# EAGLE design SmartSwitch (EAGLE 7.2.0)
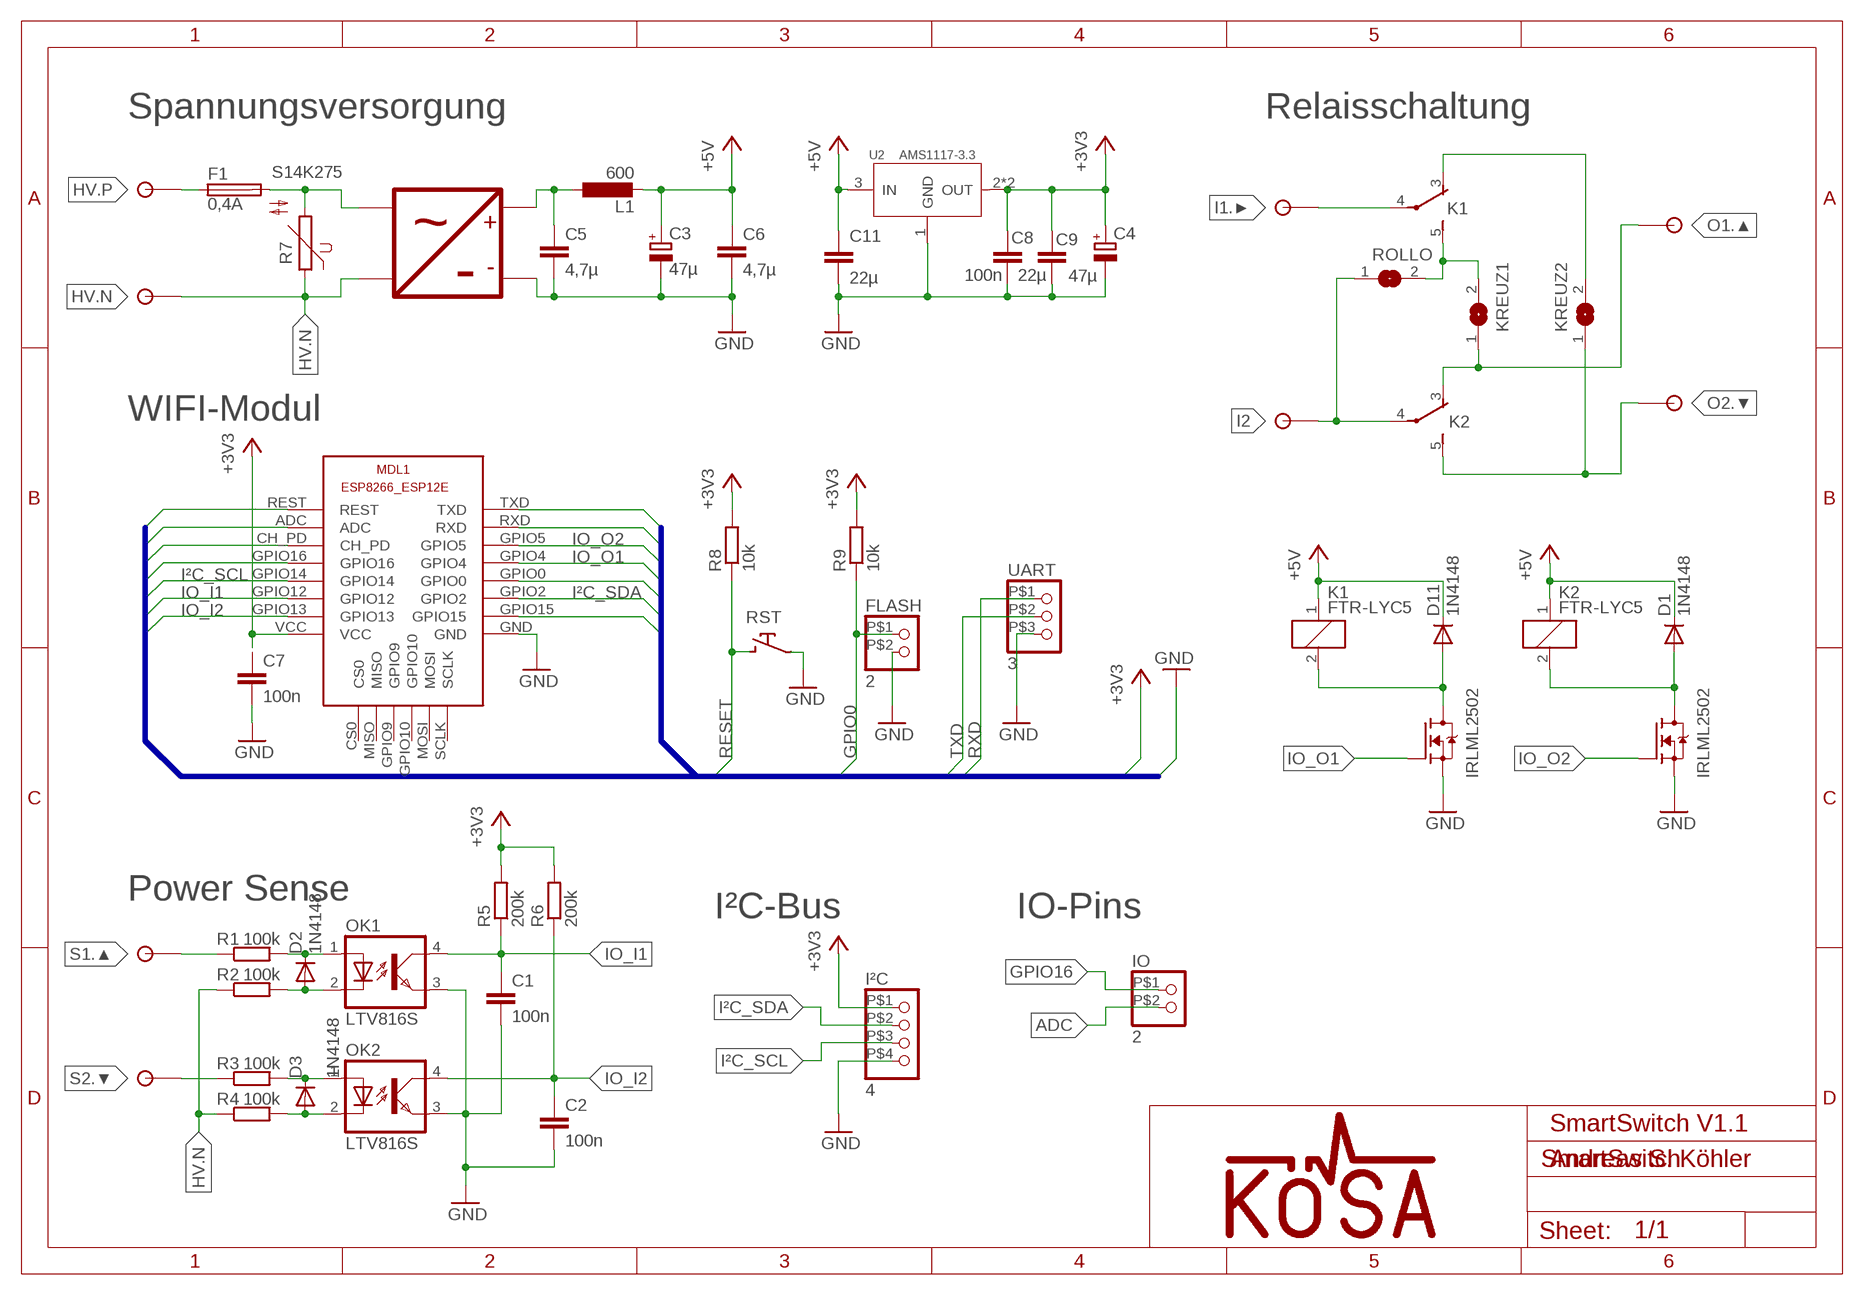
[diagram p0: schematic, sheet 1]

## Parts
C1  100n  C-EUC0805  [C0805]
C2  100n  C-EUC0805  [C0805]
C3  47µ  CPOL-EUE2-5  [E2-5]
C4  47µ  CPOL-EUE2-5  [E2-5]
C5  4,7µ  C-EUC0805  [C0805]
C6  4,7µ  C-EUC0805  [C0805]
C7  100n  C-EUC0805  [C0805]
C8  100n  C-EUC0805  [C0805]
C9  22µ  C-EUC0805  [C0805]
C11  22µ  C-EUC0805  [C0805]
D1  1N4148  DIODE-SOD323-W  [SOD323-W]
D2  1N4148  DIODE-SOD323-W  [SOD323-W]
D3  1N4148  DIODE-SOD323-W  [SOD323-W]
D11  1N4148  DIODE-SOD323-W  [SOD323-W]
F1  0,4A  SMD_FUSE_HOLDER  [SMD_FUSE_HOLDER]
FLASH  2  PINHD-1X2SMALL  [1X02_SMALL]
IO  2  PINHD-1X2SMALL  [1X02_SMALL]
I²C  4  PINHD-1X4SMALL  [1X04_SMALL]
K1  FTR-LYC5  [FTR-LYC]
K2  FTR-LYC5  [FTR-LYC]
KREUZ1  SJW  [SJW]
KREUZ2  SJW  [SJW]
L1  600  L-EUL3225P  [L3225P]
MDL1  1  ESP8266-12EESP8266-ESP12E  [ESP8266-ESP12E]
OK1  LTV816S  [SMD4]
OK2  LTV816S  [SMD4]
R1  100k  R-EU_R1206  [R1206]
R2  100k  R-EU_R1206  [R1206]
R3  100k  R-EU_R1206  [R1206]
R4  100k  R-EU_R1206  [R1206]
R5  200k  R-EU_R1206  [R1206]
R6  200k  R-EU_R1206  [R1206]
R7  S14K275  [S14K275]
R8  10k  R-EU_R1206  [R1206]
R9  10k  R-EU_R1206  [R1206]
ROLLO  SJW  [SJW]
RST  SMD-TASTER_REICHELT_KMR_231_G_LFS  [SMD-TASTER_REICHELT_KMR_231_G_LFS]
U2  AMS1117-3.3  PMIC-CJT1117-3.3(SOT223)  [SOT-223]
U$1  HLK-PM01  [HLK-PM01]
U$2  RND_205-00276  [RND205-00276]
U$3  RND_205-00276  [RND205-00276]
U$4  RND_205-00276  [RND205-00276]
U$5  RND_205-00276  [RND205-00276]
U$7  IRLML2502  [SOT23]
U$8  IRLML2502  [SOT23]
UART  3  PINHD-1X3SMALL  [1X03_SMALL]

## Nets
+3V3: C4.+ C7.1 C8.1 C9.1 I²C.P$1 MDL1.CH_PD MDL1.VCC R5.2 R6.2 R8.2 R9.2 U2.2(OUT) U2.TER(OUT)
+5V: C3.+ C6.1 C11.1 D1.C D11.C K1.1 K2.1 L1.2 U2.3(IN)
ADC: IO.P$2 MDL1.ADC
GND: C1.2 C2.2 C3.- C4.- C5.2 C6.2 C7.2 C8.2 C9.2 C11.2 FLASH.P$2 I²C.P$4 MDL1.GND MDL1.GPIO15 OK1.3(EMIT) OK2.3(EMIT) RST.1_1(A) RST.1_2(A) U2.1(GND) U$1.DC- U$7.2(S) U$8.2(S) UART.P$3
GPIO0: FLASH.P$1 MDL1.GPIO0 R9.1
GPIO16: IO.P$1 MDL1.GPIO16
HV.N: R2.1 R4.1 R7.1 U$1.AC2 U$2.P$2
HV.P: F1.P$1 U$2.P$1
I1.►: K1.4(-1:P) U$4.P$1
I2: K2.4(-1:P) ROLLO.1 U$3.P$1
IO_I1: C1.1 MDL1.GPIO12 OK1.4(COL) R5.1
IO_I2: C2.1 MDL1.GPIO13 OK2.4(COL) R6.1
IO_O1: MDL1.GPIO4 U$7.1(G)
IO_O2: MDL1.GPIO5 U$8.1(G)
I²C_SCL: I²C.P$3 MDL1.GPIO14
I²C_SDA: I²C.P$2 MDL1.GPIO2
N$3: K1.5(-1:S) KREUZ1.2 ROLLO.2
N$5: K1.3(-1:O) KREUZ2.2
N$7: C5.1 L1.1 U$1.DC+
N$8: F1.P$2 R7.2 U$1.AC1
N$11: D2.C OK1.1(A) R1.2
N$12: D3.C OK2.1(A) R3.2
N$13: D2.A OK1.2(C) R2.2
N$14: D3.A OK2.2(C) R4.2
N$17: D11.A K1.2 U$7.3(D)
N$19: D1.A K2.2 U$8.3(D)
O1.▲: K2.3(-1:O) KREUZ1.1 U$3.P$2
O2.▼: K2.5(-1:S) KREUZ2.1 U$4.P$2
RESET: MDL1.REST R8.1 RST.2_1(B) RST.2_2(B)
RXD: MDL1.RXD UART.P$1
S1.▲: R1.1 U$5.P$2
S2.▼: R3.1 U$5.P$1
TXD: MDL1.TXD UART.P$2
Unconnected: MDL1.CS0 MDL1.GPIO9 MDL1.GPIO10 MDL1.MISO MDL1.MOSI MDL1.SCLK

## Buses
RESET,ADC,CH_PD,GPIO16,I²C_SCL,IO_I1,IO_I2,TXD,RXD,IO_O1,IO_O2,GPIO0,I²C_SDA,GPIO15,GND,+3V3

## Notes on the sheet
- Spannungsversorgung | Relaisschaltung
- WIFI-Modul
- Power Sense
- I²C-Bus | IO-Pins
- SmartSwitch V1.1
- Andreas S. Köhler

## Library data of the parts
C1 C2 C5-C9 C11 = rcl:C-EU: CAPACITOR, European symbol
C3 C4 = rcl:CPOL-EU: POLARIZED CAPACITOR, European symbol
D1-D3 D11 = diode:DIODE-: DIODE
F1 = fuse:SMD_FUSE_HOLDER
FLASH IO = pinhead:PINHD-1X2: PIN HEADER
I²C = pinhead:PINHD-1X4: PIN HEADER
K1 K2 = relay:FTR-LYC: Schmales Netzrelais NETZRELAIS FTR-LYCA024V 1XUM 6A/250VAC Distributor: Conrad electronic Bestell Nr.: 504382 - 62 Source: http://www2.produktinfo.conrad.com/datenblaetter/500000-524999/504382-da-01-de-NETZRELAIS_FTR-LYCA024V_1XUM_6A_250VAC.pdf; OC_FARNELL: unknown; OC_NEWARK: unknown
KREUZ1 KREUZ2 ROLLO = jumper:SJ: SMD solder JUMPER
L1 = rcl:L-EU: INDUCTOR, European symbol
MDL1 = ESP8266-ESP12E:ESP8266-12E: ESP8266-12E with additional I/O and GPIO04/05 corrected The author cannot warrant that this library is free from error or will meet your specific requirements. Created by PuceBaboon.com. Komagane, Nagano, JAPAN
OK1 OK2 = optocoupler:LTV816: OPTO COUPLER Source: LITEON, LTV816.pdf; OC_FARNELL: unknown; OC_NEWARK: unknown
R1-R6 R8 R9 = rcl:R-EU_: RESISTOR, European symbol
R7 = varistor:S14K275: VARISTOR
RST = @ CUSTOM:SMD-TASTER_REICHELT_KMR_231_G_LFS
U2 = Seeed-OPL-ic:PMIC-CJT1117-3.3(SOT223): 310030097; MPN: CJT1117-3.3; VALUE: CJT1117-3.3-SOT223
U$1 = @ CUSTOM:HLK-PM01
U$2-U$5 = @ CUSTOM:RND_205-00276
U$7 U$8 = transistor-fet:IRLML2502
UART = pinhead:PINHD-1X3: PIN HEADER

## Board
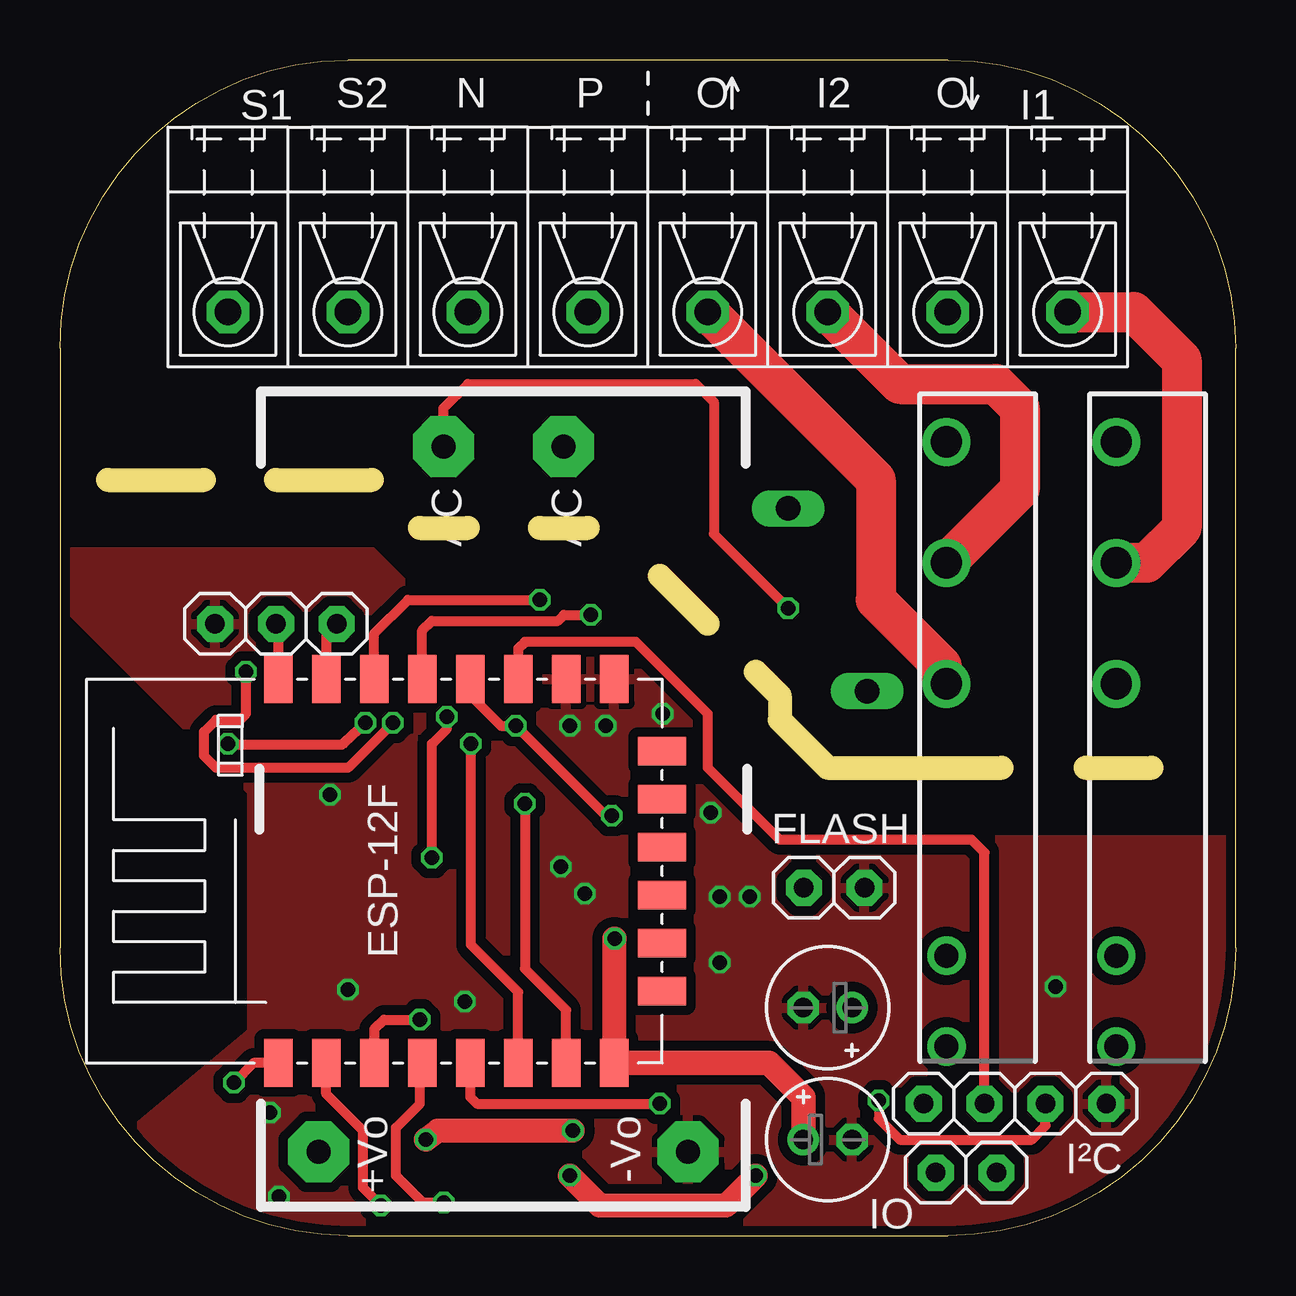
[diagram p1: board, top side]
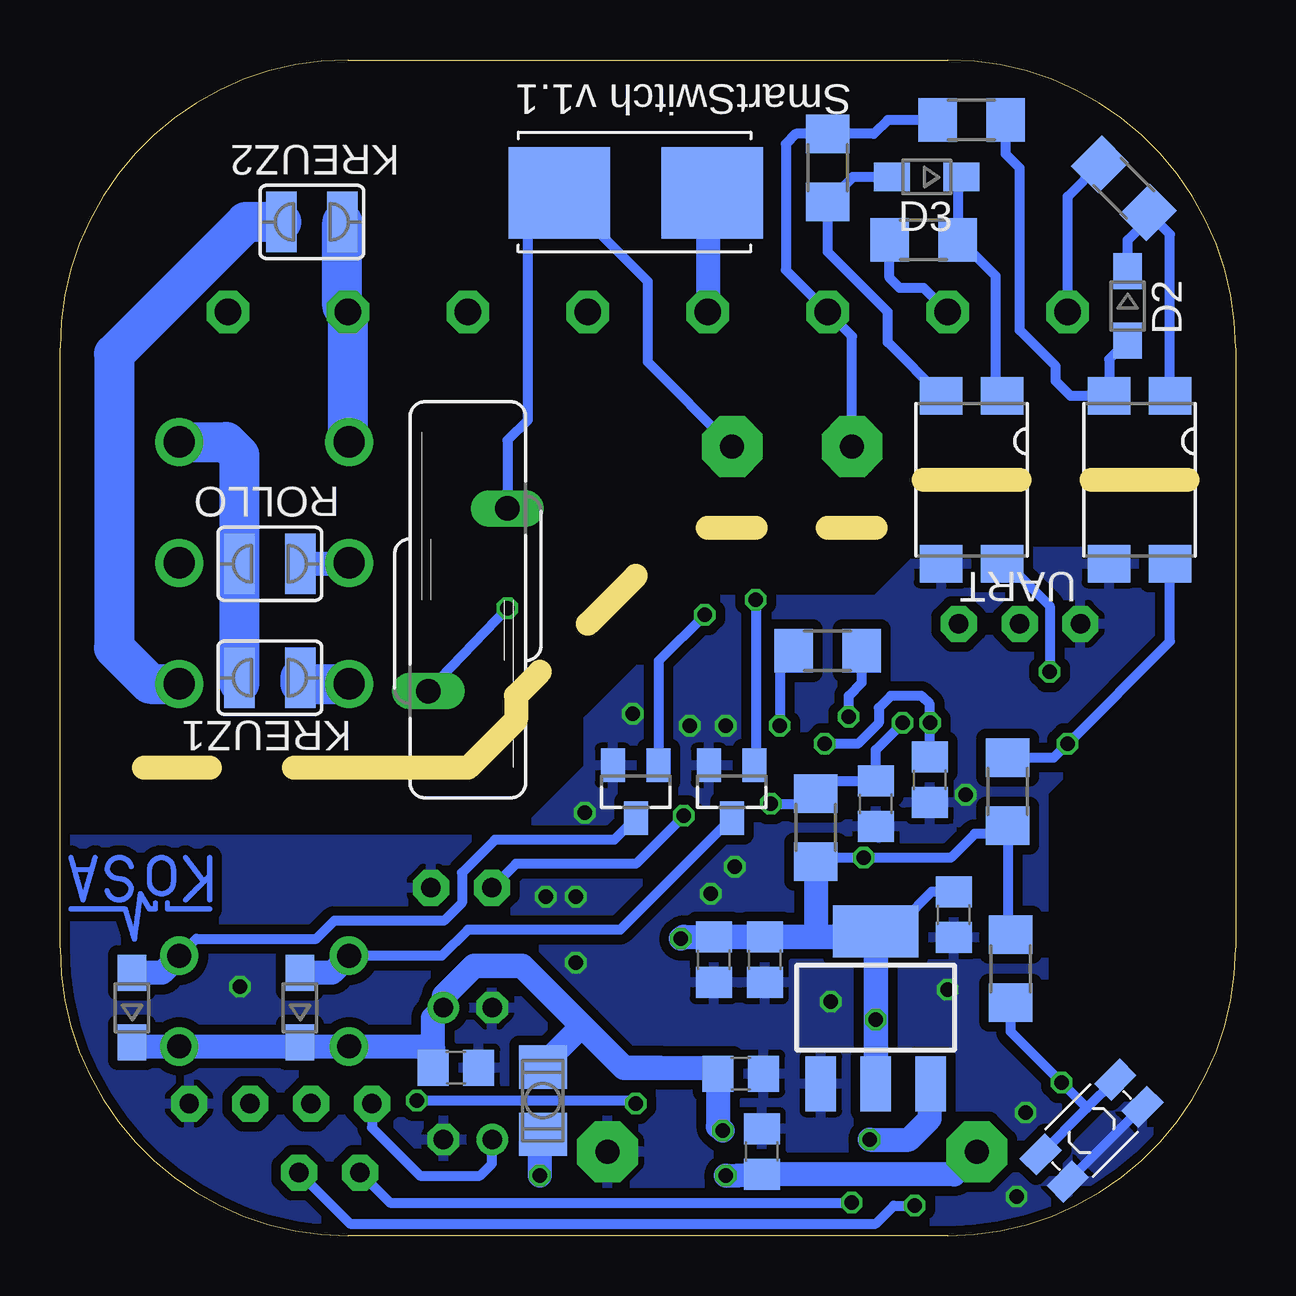
[diagram p2: board, bottom side, seen from below]

Size 49 x 49 mm. Coordinates in mm from the lower left corner, seen from the top.
Outline: 12,0 37,0 arc90 49,12 49,37 arc90 37,49 12,49 arc90 0,37 0,12 arc90 12,0
Copper layers (1*16): Top 0.035mm / dielectric 1.5mm / Bottom 0.035mm
Design rules "default": minimum track width 6mil, minimum drill 12mil, track to track 6mil, track to pad 6mil, pad to pad 6mil, via to via 6mil, smd to smd 0mil, copper to edge 10mil, drill to drill 10mil, minimum pad ring 10mil, minimum via ring 6mil, stop-mask expansion 2mil, vias tented up to drill 100mil, thermal gap 10mil
tKeepout: 7 lines
bKeepout: 7 lines
Milling: 10 lines

### Footprints (pad centres in the part's own frame; a part is rotated, then mirrored left to right if it is on the bottom)
C0805 = smd 1.3 x 1.5: 1 -0.95,0; 2 0.95,0
E2-5 = drill 0.813 pad 1.27: + -1.016,0 | drill 0.813 pad 1.27 octagon: - 1.016,0
SOD323-W = smd 1.5 x 1.2: A 1.45,0; C -1.45,0
SMD_FUSE_HOLDER = smd 4.24 x 3.81: P$1 -3.19,0.04; P$2 3.19,0.04
1X02_SMALL = drill 0.8 pad 1.5 octagon: P$1 0,0; P$2 2.54,0
1X04_SMALL = drill 0.8 pad 1.5 octagon: P$1 0,0; P$2 2.54,0; P$3 5.08,0; P$4 7.62,0
FTR-LYC = drill 1 pad 1.6: 1 -3.78,0; 2 0,0 | drill 1.3 pad 2: 3 11.34,0; 4 16.38,0; 5 21.42,0
SJW = smd 1.27 x 2.54: 1 -1.27,0; 2 1.27,0
L3225P = smd 1.8 x 2: 1 -1.4,0; 2 1.4,0
ESP8266-ESP12E = smd 2 x 1.2: ADC -8,15; CH_PD -8,13; GND 8,3; GPIO0 8,9; GPIO2 8,7; GPIO4 8,11; GPIO5 8,13; GPIO12 -8,7; GPIO13 -8,5; GPIO14 -8,9; GPIO15 8,5; GPIO16 -8,11; REST -8,17; RXD 8,15; TXD 8,17; VCC -8,3 | smd 1.2 x 2: CS0 -5,1; GPIO9 -1,1; GPIO10 1,1; MISO -3,1; MOSI 3,1; SCLK 5,1
SMD4 = smd 1.78 x 1.55: 1 -1.27,-3.5; 2 1.27,-3.5; 3 1.27,3.5; 4 -1.27,3.5
R1206 = smd 1.6 x 1.803: 1 -1.422,0; 2 1.422,0
S14K275 = drill 1.016 long: 1 -1.651,-3.81; 2 1.651,3.81
SMD-TASTER_REICHELT_KMR_231_G_LFS = smd 1.5 x 1: 1_1 -2.2,0.8; 1_2 2.2,0.8; 2_1 -2.2,-0.8; 2_2 2.2,-0.8
SOT-223 = smd 1.27 x 2.286: 1 -2.286,-3.175; 2 0,-3.175; 3 2.286,-3.175 | smd 3.556 x 2.159: TER 0,3.175
HLK-PM01 = drill 1 pad 2.54 octagon: AC1 -14.7,2.5; AC2 -14.7,-2.5; DC+ 14.7,-7.7; DC- 14.7,7.7
RND205-00276 = drill 1.1 pad 1.778 octagon: P$1 0,0; P$2 5,0
SOT23 = smd 1 x 1.4: 1 -0.95,-1.1; 2 0.95,-1.1; 3 0,1.1
1X03_SMALL = drill 0.8 pad 1.5 octagon: P$1 -2.54,0; P$2 0,0; P$3 2.54,0

### Placement (x,y rotation side)
C1  12.75,19 270 bottom
C2  15,18 270 bottom
C3  32,9.5 180 top
C4  32,4 0 top
C5  19.75,3.5 90 bottom
C6  32.5,7 0 bottom
C7  11.75,13.38 270 bottom
C8  19.62,11.5 270 bottom
C9  21.75,11.5 270 bottom
C11  20.62,6.75 0 bottom
D1  39,9.5 90 bottom
D2  4.5,38.75 270 bottom
D3  12.88,44.12 180 bottom
D11  46,9.5 90 bottom
F1  25,43.5 180 bottom
FLASH  31,14.5 0 top
IO  36.5,2.62 0 top
I²C  36,5.5 0 top
K1  44.03,11.66 90 top
K2  36.95,11.66 90 top
KREUZ1  40.25,23.25 180 bottom
KREUZ2  38.5,42.25 180 bottom
L1  28.88,5.62 90 bottom
MDL1  26.1,15.19 90 top
OK1  4,31.5 180 bottom
OK2  11,31.5 180 bottom
R1  4.65,43.65 315 bottom
R2  11,46.5 0 bottom
R3  13,41.5 0 bottom
R4  17,44.5 270 bottom
R5  9.5,18.5 270 bottom
R6  17.5,17 270 bottom
R7  32,26.5 0 bottom
R8  9.38,11.12 90 bottom
R9  17,24.38 0 bottom
ROLLO  40.25,28 180 bottom
RST  6,4.38 225 bottom
U2  15,9.5 0 bottom
U$1  18.48,18.19 270 top
U$2  22,38.5 180 top
U$3  32,38.5 180 top
U$4  42,38.5 180 top
U$5  12,38.5 180 top
U$7  25,18.5 180 bottom
U$8  21,18.5 180 bottom
UART  9,25.5 180 top

### Tracks (layer width: path | path; a pad name or v marks a point on that pad's centre or on a via)
+3V3  (via drill 0.6)
  Top 0.406: 13,7.19 MDL1.CH_PD 13.1,8.6 13.5,9 v15,9 | v15.5,15.75 15.5,20.5 16.12,21.12 v16.12,21.62
  Top 1: MDL1.VCC 23.1,12.38 v23.12,12.38
  Top 1.016: C4.+ 30.98,5.77 29.56,7.19 MDL1.VCC
  Bottom 0.406: 17.33,15.75 arc-90 R6.2 17.3,15.75 v15.5,15.75 11.88,15.75 10.88,16.75 9.83,16.75 R5.2 9.5,12.67 R8.2 | v16.12,21.62 16.12,22.5 15.58,23.05 R9.2 | I²C.P$1 36,4.5 34,2.5 31.5,2.5 31,3 31,3.98 C4.+ | C7.1 12.68,14.32 13.88,13.12 14.55,13.12 U2.TER
  Bottom 1: v23.12,12.38 23,12.45 C9.1 | 17.5,15.25 17.5,12.45 18,12.45
  Bottom 1.016: U2.2 v15,9 U2.TER 15.22,12.45 18,12.45 C8.1 C9.1 | R6.2 17.5,15.25
+5V  (via drill 0.6)
  Top 1: v21.38,4.38 15.75,4.38 v15.25,4
  Bottom 1: D11.C 45.83,7.88 K1.1 39.17,7.88 arc-90 D1.C 38.83,7.88 K2.1 33.45,7.88 | v15.25,4 13.62,4 12.75,4.88 12.75,6.29 U2.3 | v21.38,4.38 21.57,4.55 C11.1 21.7,7 24,7 | L1.2 28.88,7.12 27.25,8.75 | C3.+ 33.45,9.07 33.45,7.88 | 33.45,7.88 C6.1
  Bottom 1.016: C3.+ 33,9.52 33,10 31.75,11.25 29.75,11.25 27.25,8.75 25.5,7 24,7
ADC  (via drill 0.6)
  Top 0.406: MDL1.ADC 11.1,5.9 12.62,4.38 12.62,2 v13.38,1.25
  Bottom 0.406: IO.P$2 36.91,0.5 15,0.5 14.25,1.25 v13.38,1.25
GND  (via drill 0.6)
  Bottom 0.406: RST.1_1 RST.1_2
  Bottom 1: U$1.DC-
  other vias: 21.25,21.25 22.75,21.25 25.12,21.75 27.12,17.62 27.5,14.12 28.75,14.12 20.88,15.38 21.88,14.25 11.25,18.38 16.88,9.75 27.5,11.38 41.5,10.38 9.12,1.62 8.75,5.12 12,10.25
  pour Top (isolate 0.406): 0,26.5 0,28.5 13,28.5 15,26.5 22,26.5 27,21.5 27,19.5 30,16.5 49.5,16.5 49.5,13.5 arc-90 39,-0.5 10,-0.5 6,0.5 2,3.5 8,8.5 8,18.5
  pour Bottom (isolate 0.406): 0,26.5 0,28.5 13,28.5 15,26.5 22,26.5 27,21.5 27,19.5 30,16.5 49.5,16.5 49.5,11.5 arc-90 38,-0.5 10,-0.5 6,0.5 2,3.5 8,8.5 8,18.5
GPIO0  (via drill 0.6)
  Top 0.406: MDL1.GPIO0 17.1,22.52 18.38,21.25 v19,21.25 22.75,17.5 v23,17.5
  Bottom 0.406: R9.1 18.38,24.45 19,23.83 v19,21.25 | v23,17.5 25,15.5 30,15.5 FLASH.P$1
GPIO16  (via drill 0.6)
  Top 0.406: v16,1.38 15.12,1.38 14,2.5 14,4.5 15,5.5 15,7.09 MDL1.GPIO16
  Bottom 0.406: IO.P$1 35.25,1.38 v16,1.38
HV.N  (via drill 0.6)
  Top 0.406: U$1.AC2 15.98,34.48 17,35.5 26.5,35.5 27.25,34.75 27.25,29.25 v30.35,26.15
  Bottom 0.406: U$1.AC2 15.98,37.48 U$2.P$2 18.75,40.25 18.75,45.5 18.33,45.92 R4.1 15.08,45.92 14.5,46.5 R2.1 | v30.35,26.15 R7.1
HV.P
  Bottom 1: F1.P$1 22,43.46 U$2.P$1
I1.►
  Top 1.676: U$4.P$1 44.75,38.5 46.75,36.5 46.75,29.5 45.29,28.04 K1.4
I2
  Top 1.676: U$3.P$1 35,35.5 39,35.5 40,34.5 40,31.09 K2.4
  Bottom 1: K2.4 36.99,28 ROLLO.1
IO_I1  (via drill 0.6)
  Top 0.406: v12.72,21.38 11.85,20.55 11.75,20.45 7.05,20.45 v7,20.5 | MDL1.GPIO12 19.1,10.15 17.12,12.12 v17.12,20.5
  Bottom 0.406: R5.1 7.58,19.92 v7,20.5 2.73,24.77 OK1.4 | 12.75,21.38 12.75,22.15 13.1,22.5 14.38,22.5 14.88,22 14.88,21.38 15.75,20.5 v17.12,20.5 | C1.1 12.75,21.38 | 12.75,21.38 v12.72,21.38
IO_I2  (via drill 0.6)
  Top 0.406: v13.88,21.38 12,19.5 6.5,19.5 6,20 6,21 6.5,21.5 7.5,21.5 7.75,21.75 v7.75,23.5 | MDL1.GPIO13 21.1,9.4 19.38,11.12 v19.38,18
  Bottom 0.406: v7.75,23.5 7.75,26.25 9.75,28.25 10.38,28.25 9.73,27.61 OK2.4 | v19.38,18 17.88,18 17.5,18.38 R6.1 16.97,18.95 C2.1 15,20.25 v13.88,21.38
IO_O1  (via drill 0.6)
  Top 0.406: MDL1.GPIO4 15.1,25.23 15.5,25.62 20.75,25.62 21,25.88 v22.12,25.88
  Bottom 0.406: v22.12,25.88 24.05,23.95 U$7.1
IO_O2  (via drill 0.6)
  Top 0.406: v20,26.5 14.5,26.5 13.1,25.1 MDL1.GPIO5
  Bottom 0.406: v20,26.5 20,19.65 U$8.1
I²C_SCL  (via drill 0.6)
  Top 0.406: MDL1.GPIO14 17.1,5.78 17.38,5.5 v25,5.5 | I²C.P$3 41.08,4.58 40.5,4 35,4 34.12,4.88 v34.12,5.62
  Bottom 0.406: v25,5.5 25.12,5.62 v34.12,5.62
I²C_SDA
  Top 0.406: I²C.P$2 38.54,15.96 38,16.5 30,16.5 27,19.5 27,21.75 24,24.75 19.38,24.75 19.1,24.48 MDL1.GPIO2
N$3
  Bottom 1.676: K1.5 42.08,33.08 41.52,32.52 ROLLO.2 KREUZ1.2 41.52,23.02
N$5
  Bottom 1.676: KREUZ2.2 41.25,42.25 46.75,36.75 46.75,24.5 45.25,23 K1.3
N$7  (via drill 0.6)
  Top 1: v29,2.5 27.75,1.25 22.5,1.25 v21.25,2.5
  Bottom 1: v21.25,2.5 arc-3 C5.1 11.72,2.55 U$1.DC+ | v29,2.5 29,4.1 L1.1
N$8
  Bottom 0.406: U$1.AC1 24.5,36.41 24.5,39.77 F1.P$2 | 29.5,42 29.5,34 30.35,33.15 R7.2
  Bottom 1: 29.5,42 28.19,43.31 | 28.19,43.31 28,43.5 | F1.P$2 28.19,43.31
N$11
  Bottom 0.406: OK1.1 2.73,41.73 R1.2 4,42.28 4,42 4.5,41.5 D2.C
N$12
  Bottom 0.406: OK2.1 10,35.27 10,40 11.5,41.5 R3.2 11.58,43.97 D3.C
N$13
  Bottom 0.406: R2.2 9.58,45.08 9,44.5 9,37.73 7.5,36.23 7.5,35.62 6.88,35 OK1.2 5.27,36.53 D2.A
N$14
  Bottom 0.406: OK2.2 14.5,37.23 14.5,38.5 17,41 R4.2 15.95,44.12 D3.A
N$17
  Bottom 0.406: U$7.3 25.9,16.5 30.88,16.5 32.25,15.12 32.25,13.88 33,13.12 37.56,13.12 38.31,12.38 43.31,12.38 K1.2
  Bottom 1: K1.2 44.74,10.95 D11.A
N$19
  Bottom 0.406: U$8.3 25.65,12.75 32,12.75 33.09,11.66 K2.2
  Bottom 1: K2.2 37.66,10.95 D1.A
O1.▲
  Top 1: 36.75,23.3 K2.3
  Top 1.676: 36.75,23.3 36.75,23.75 34,26.5 34,31.5 U$3.P$2
  Bottom 1.676: KREUZ1.1 38.98,23 K2.3
O2.▼
  Bottom 1: U$4.P$2 37.23,38.73 | K2.5 37,33.13
  Bottom 1.676: 37.23,38.73 KREUZ2.1 | 37,33.13 U$4.P$2
RESET  (via drill 0.6)
  Top 0.406: MDL1.REST 8.06,7.19 v7.25,6.38
  Bottom 0.406: RST.2_2 6.19,5.32 | 6.19,5.32 RST.2_1 | R8.1 9.38,8.5 v7.25,6.38 6.82,5.94 6.19,5.32
RXD
  Top 0.406: UART.P$1 11.1,25.06 MDL1.RXD
S1.▲
  Bottom 0.406: U$5.P$2 7,43.3 R1.1
S2.▼
  Bottom 0.406: U$5.P$1 13,39.5 14,39.5 14.42,39.92 R3.1
TXD
  Top 0.406: UART.P$2 9.1,25.4 MDL1.TXD
(copper drawn outside any net)
  shapes: Bottom area x2118

### Text on the board
bPlace: SmartSwitch v1.1
tNames: S2 | N | P | O | I2 | O | S1 | I1